# Altium schematic sheet Microcontroller.SchDoc
size A3; SheetNumber: 4; SheetTotal: 5
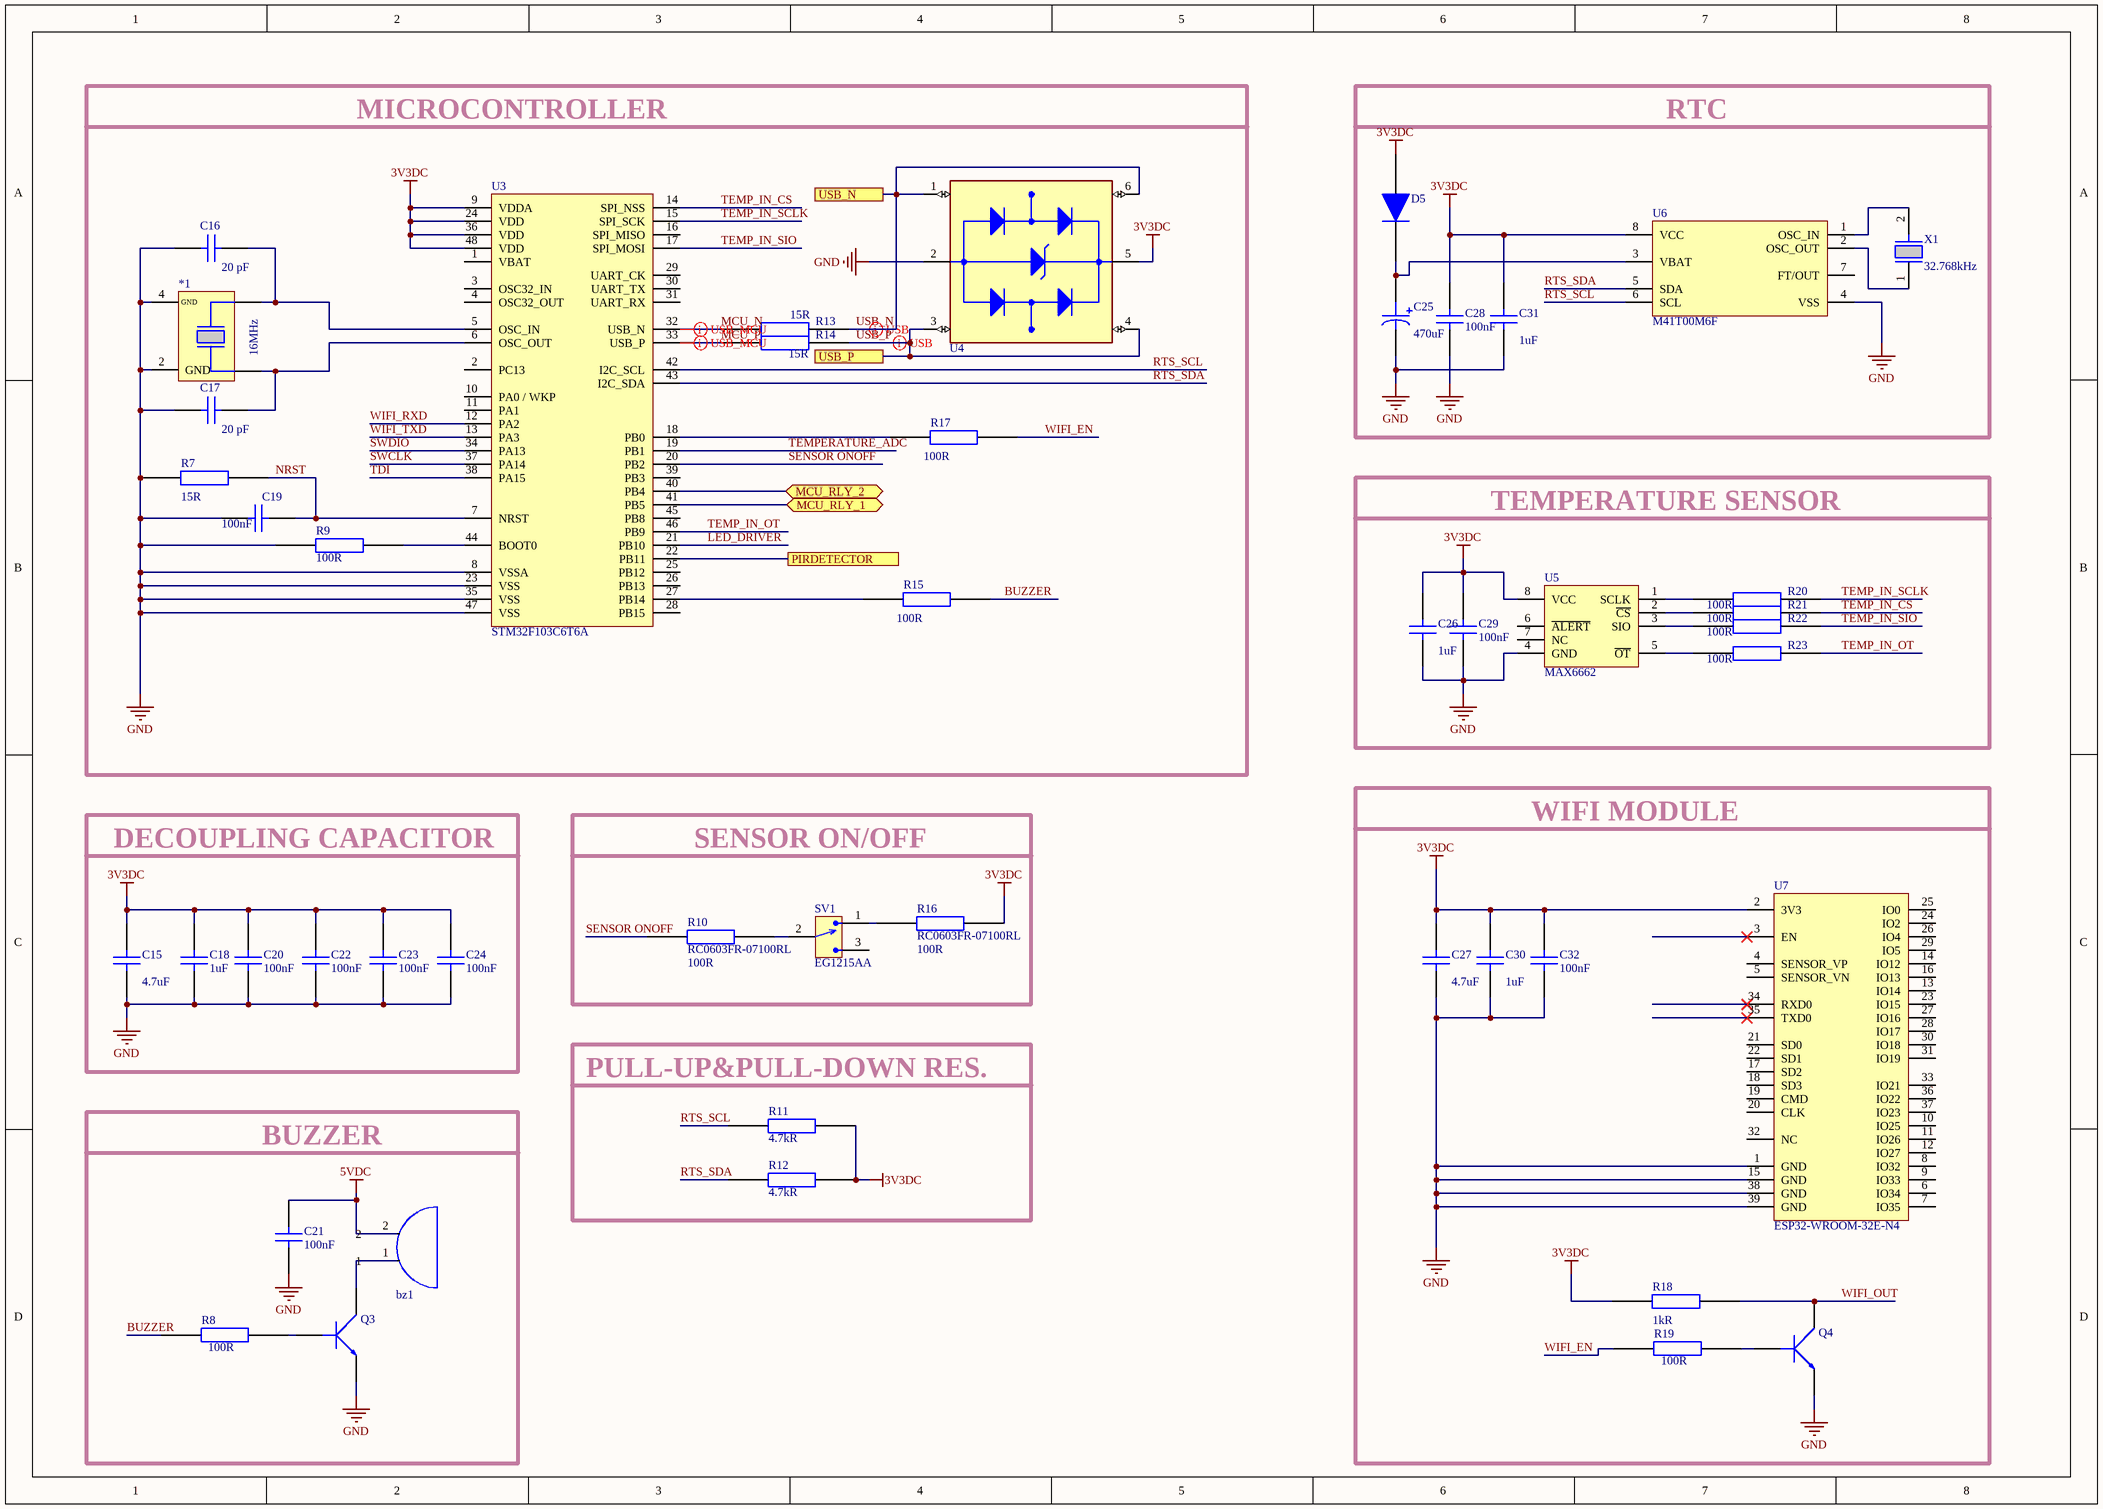
[diagram p0: Microcontroller.SchDoc]

## Parts
*1  Frequency: 16MHz  [ECS]  (hidden comment: CRYSTAL 16MHz)
bz1  2223-CMI-9605IC-0580T-ND  [CMI-9605IC]  (value not drawn)
C15  value 4.7uF  [CAP_0805]  (hidden comment: CL21A475KAQNNNE)
C16  Capaticance: 20 pF  [CAP_0603]  (hidden comment: CL10C200JB8NNNC)
C17  Capaticance: 20 pF  [CAP_0603]  (hidden comment: CL10C200JB8NNNC)
C18  value 1uF  [CAP_0805]  (hidden comment: CL21B105KBFNNNE)
C19  value 100nF  [CAP_0603]  (hidden comment: C0603C104K5RAC7867)
C20  value 100nF  [CAP_0603]  (hidden comment: C0603C104K5RAC7867)
C21  value 100nF  [CAP_0603]  (hidden comment: C0603C104K5RAC7867)
C22  value 100nF  [CAP_0603]  (hidden comment: C0603C104K5RAC7867)
C23  value 100nF  [CAP_0603]  (hidden comment: C0603C104K5RAC7867)
C24  value 100nF  [CAP_0603]  (hidden comment: C0603C104K5RAC7867)
C25  value 470uF  [CAP_EEVSRIES]  (hidden comment: EEV477M025A9PAA)
C26  value 1uF  [CAP_0805]  (hidden comment: CL21B105KBFNNNE)
C27  value 4.7uF  [CAP_0805]  (hidden comment: CL21A475KAQNNNE)
C28  value 100nF  [CAP_0603]  (hidden comment: C0603C104K5RAC7867)
C29  value 100nF  [CAP_0603]  (hidden comment: C0603C104K5RAC7867)
C30  value 1uF  [CAP_0805]  (hidden comment: CL21B105KBFNNNE)
C31  value 1uF  [CAP_0805]  (hidden comment: CL21B105KBFNNNE)
C32  value 100nF  [CAP_0603]  (hidden comment: C0603C104K5RAC7867)
D5  1N4148WS-7-F  [SOD323F]  (value not drawn)
Q3  MMBT3904-7-F  [SOT-23F]  (value not drawn)
Q4  MMBT3904-7-F  [SOT-23F]  (value not drawn)
R7  value 15R  [RES_0603]  (hidden comment: RC0603FR-0715RL)
R8  value 100R  [RES_0603]  (hidden comment: RC0603FR-07100RL)
R9  value 100R  [RES_0603]  (hidden comment: RC0603FR-07100RL)
R10  RC0603FR-07100RL  value 100R  [RES_0603]
R11  value 4.7kR  [RES_0603]  (hidden comment: RC0603FR-074K7L)
R12  value 4.7kR  [RES_0603]  (hidden comment: RC0603FR-074K7L)
R13  value 15R  [RES_0603]  (hidden comment: RC0603FR-0715RL)
R14  value 15R  [RES_0603]  (hidden comment: RC0603FR-0715RL)
R15  value 100R  [RES_0603]  (hidden comment: RC0603FR-07100RL)
R16  RC0603FR-07100RL  value 100R  [RES_0603]
R17  value 100R  [RES_0603]  (hidden comment: RC0603FR-07100RL)
R18  value 1kR  [RES_0603]  (hidden comment: RC0603FR-0710KL)
R19  value 100R  [RES_0603]  (hidden comment: RC0603FR-07100RL)
R20  value 100R  [RES_0603]  (hidden comment: RC0603FR-07100RL)
R21  value 100R  [RES_0603]  (hidden comment: RC0603FR-07100RL)
R22  value 100R  [RES_0603]  (hidden comment: RC0603FR-07100RL)
R23  value 100R  [RES_0603]  (hidden comment: RC0603FR-07100RL)
SV1  EG1215AA  [EG1215AA]
U3  STM32F103C6T6A  [LQFP-48]
U4  USBLC6-2SC6  [SOT23-6L]  (value not drawn)
U5  MAX6662  [SOIC8]
U6  M41T00M6F  [SOIC8]
U7  ESP32-WROOM-32E-N4  [ESP32-32E]
X1  Frequency: 32.768kHz  [ABS05]  (hidden comment: ABS05-32.768KHZ-T)

## Ports
MCU_RLY_1 (bidir, see Power Manangement[4B]), MCU_RLY_2 (bidir, see Power Manangement[6B]), PIRDETECTOR (see Power Manangement[6D], Sensor Board[4B], Sensor Board[6A], Sensor Board[7A]), USB_N (see Power Manangement[6C]), USB_P (see Power Manangement[6C])

## Nets
3V3DC: C15.2 C18.1 C20.1 C22.1 C23.1 C24.1 C26.2 C27.2 C28.2 C29.2 C30.2 C31.2 C32.2 D5.2 R11.1 R12.1 R16.2 R18.1 U3.9(VDDA) U3.24(VDD) U3.36(VDD) U3.48(VDD) U4.5(VBUS) U5.8(VCC) U6.8(VCC) U7.2(3V3)
5VDC: bz1.2 C21.2
GND: *1.2(GND) *1.4(GND) C15.1 C16.1 C17.1 C18.2 C19.1 C20.2 C21.1 C22.2 C23.2 C24.2 C25.2 C26.1 C27.1 C28.1 C29.1 C30.1 C31.1 C32.1 Q3.2(E) Q4.2(E) R7.1 R9.2 U3.8(VSSA) U3.23(VSS) U3.35(VSS) U3.47(VSS) U4.2(GND) U5.4(GND) U6.4(VSS) U7.1(GND) U7.15(GND) U7.38(GND) U7.39(GND)
BUZZER: R8.1 R15.2
LED_DRIVER: U3.21(PB10)
MCU_N: R13.1 U3.32(USB_N)
MCU_P: R14.1 U3.33(USB_P)
MCU_RLY_1: U3.41(PB5) ; port MCU_RLY_1
MCU_RLY_2: U3.40(PB4) ; port MCU_RLY_2
NRST: C19.2 R7.2 U3.7(NRST)
PIRDETECTOR: U3.22(PB11) ; port PIRDETECTOR
RTS_SCL: R11.2 U3.42(I2C_SCL) U6.6(SCL)
RTS_SDA: R12.2 U3.43(I2C_SDA) U6.5(SDA)
SENSOR ONOFF: R10.2 U3.20(PB2)
SWCLK: U3.37(PA14)
SWDIO: U3.34(PA13)
TDI: U3.38(PA15)
TEMP_IN_CS: R21.2 U3.14(SPI_NSS)
TEMP_IN_OT: R23.2 U3.46(PB9)
TEMP_IN_SCLK: R20.2 U3.15(SPI_SCK)
TEMP_IN_SIO: R22.2 U3.17(SPI_MOSI)
TEMPERATURE_ADC: U3.19(PB1)
USB_N: R13.2 U4.1(I/O1_IN) U4.6(I/O1_OUT) ; port USB_N
USB_P: R14.2 U4.3(I/O2_IN) U4.4(I/O2_OUT) ; port USB_P
WIFI_EN: R17.2 R19.1
WIFI_OUT: Q4.3(C) R18.2
WIFI_RXD: U3.12(PA2)
WIFI_TXD: U3.13(PA3)
Net*1_1: *1.1 C17.2 U3.6(OSC_OUT)
Net*1_3: *1.3 C16.2 U3.5(OSC_IN)
Netbz1_1: bz1.1 Q3.3(C)
NetC25_1: C25.1 D5.1 U6.3(VBAT)
NetQ3_1: Q3.1(B) R8.2
NetQ4_1: Q4.1(B) R19.2
NetR9_1: R9.1 U3.44(BOOT0)
NetR10_1: R10.1 SV1.2
NetR15_1: R15.1 U3.27(PB14)
NetR16_1: R16.1 SV1.1
NetR17_1: R17.1 U3.18(PB0)
NetR20_1: R20.1 U5.1(SCLK)
NetR21_1: R21.1 U5.2(~{CS})
NetR22_1: R22.1 U5.3(SIO)
NetR23_1: R23.1 U5.5(~{OT})
NetU6_1: U6.1(OSC_IN) X1.2
NetU6_2: U6.2(OSC_OUT) X1.1

Not connected (* = marked no-connect by the designer): SV1 3; U3 1(VBAT) 2(PC13) 3(OSC32_IN) 4(OSC32_OUT) 10(PA0_/_WKP_) 11(PA1) 16(SPI_MISO) 25(PB12) 26(PB13) 28(PB15) 29(UART_CK) 30(UART_TX) 31(UART_RX) 39(PB3) 45(PB8); U5 6(~{ALERT}) 7(NC); U6 7(FT/OUT); U7 3(EN)* 4(SENSOR_VP) 5(SENSOR_VN) 6(IO34) 7(IO35) 8(IO32) 9(IO33) 10(IO25) 11(IO26) 12(IO27) 13(IO14) 14(IO12) 16(IO13) 17(SD2) 18(SD3) 19(CMD) 20(CLK) 21(SD0) 22(SD1) 23(IO15) 24(IO2) 25(IO0) 26(IO4) 27(IO16) 28(IO17) 29(IO5) 30(IO18) 31(IO19) 32(NC) 33(IO21) 34(RXD0)* 35(TXD0)* 36(IO22) 37(IO23)

## Layout directives
differential pair: MCU_N, MCU_P, USB_N, USB_P

## Notes on the sheet
- MICROCONTROLLER
- RTC
- TEMPERATURE SENSOR
- DECOUPLING CAPACITOR
- SENSOR ON/OFF
- WIFI MODULE
- (near R11) PULL-UP&PULL-DOWN RES.
- BUZZER

## Library data of the parts
*1 = CRYSTAL 16MHz: Crystal 16MHz ±30ppm (Tol) ±50ppm (Stability) 20pF FUND 50Ohm 4-Pin Mini-SMD T/R; Manufacturer: ECS International; Manufacturer Part Number: ECS-160-20-30B-TR; Designed By: Selenay; Supplier: Digikey; Supplier Part Number: XC1120CT-ND; RoHS: Yes; Category: Crystals; Stock: 8959; Pricing: 1=1,34, 10=1,281, 50=1,2514, 100=1,0726, 500=1,04282 (USD); ComponentLink1URL: https://datasheet.ciiva.com/853/ecx-53b-853408.pdf?src-supplier=Digikey; ComponentLink1Description: https://datasheet.ciiva.com/853/ecx-53b-853408.pdf?src-supplier=Digikey; ComponentLink2URL: https://datasheet.ciiva.com/853/ecx-53b-853407.pdf?src-supplier=Digikey; ComponentLink2Description: https://datasheet.ciiva.com/853/ecx-53b-853407.pdf?src-supplier=Digikey; ComponentLink3URL: https://datasheet.ciiva.com/853/ecx-53b-853406.pdf?src-supplier=Digikey; ComponentLink3Description: https://datasheet.ciiva.com/853/ecx-53b-853406.pdf?src-supplier=Digikey
bz1 = 2223-CMI-9605IC-0580T-ND: Audio Buzzer Magnetic 3VDC 7VDC 30mA 5VDC 85dB 2600Hz to 2800Hz Through Hole Pin Box; Manufacturer: CUI Devices; Designed by: Selenay; Shape: 4456Shape; Supplier: Digikey; Supplier Part Number: 2223-CMI-9605IC-0580T-ND; Manufacturer Part Number: CMI-9605IC-0580T; RoHS: No; Category: Audio Products; Stock: 5375; Pricing: 1=1,22, 10=1,014, 25=0,938, 50=0,883, 100=0,8298, 250=0,76976, 500=0,71396, 1000=0,66741, 5000=0,65403 (USD); Length: 9.6mm; Width: 9.6mm; Height: 5mm; Case/Package: CMI-9605IC
C15 C27 = CAP CER 4.7uF 0805: Multilayer Ceramic Capacitor, 4.7 uF, 25 V, ± 10%; Manufacturer: Samsung; Voltage Rating: 25V; Dielectric: X5R; Designed By: Selenay; Supplier: Digikey; Supplier Part Number: 1276-1244-1-ND; Manufacturer Part Number: CL21A475KAQNNNE; RoHS: Yes; Category: Ceramic Capacitors; Stock: 3215685; Pricing: 1=0,1, 10=0,069, 50=0,0414, 100=0,0326, 500=0,02408, 1000=0,01994 (USD); Mounting Technology: Surface Mount; Case/Package: 0805; Case Code (Metric): 2012; Case Code (Imperial): 0805; Material: Ceramic; Min Operating Temperature: -55°C; Max Operating Temperature: 85°C; Packaging: Tape and Reel; Tolerance: 10%; Voltage Rating (DC): 25V; Series: CL; Construction: Flat; Length: 2mm; Height: 1.25mm; Depth: 1.25mm; Radiation Hardening: No; Lead Free: Lead Free; RoHS Compliant: Yes; ComponentLink1URL: https://datasheet.ciiva.com/25798/cl21a475kaqnnne-25798882.pdf?src-supplier=Digikey; ComponentLink1Description: https://datasheet.ciiva.com/25798/cl21a475kaqnnne-25798882.pdf?src-supplier=Digikey
C16 C17 = CAP CER 20pF 0603: Multilayer Ceramic Capacitor, 20 pF, 50 V, ± 5%; Manufacturer: Samsung; Designed By: Selenay; Voltage Rating (DC): 50V; Supplier: Digikey; Supplier Part Number: 1276-1187-1-ND; Manufacturer Part Number: CL10C200JB8NNNC; RoHS: Yes; Category: Ceramic Capacitors; Stock: 298649; Pricing: 1=0,1, 10=0,041, 50=0,0238, 100=0,0184, 500=0,01386, 1000=0,01089 (USD); ComponentLink1URL: https://datasheet.ciiva.com/26877/getdatasheetpartid-640634-26877974.pdf?src-supplier=Verical; ComponentLink1Description: https://datasheet.ciiva.com/26877/getdatasheetpartid-640634-26877974.pdf?src-supplier=Verical; ComponentLink2URL: https://datasheet.ciiva.com/26310/mlcc-catalogdownload2013-eng-26310315.pdf?src-supplier=Distrelec; ComponentLink2Description: https://datasheet.ciiva.com/26310/mlcc-catalogdownload2013-eng-26310315.pdf?src-supplier=Distrelec
C18 C26 C30 C31 = CAP CER 1uF 0805: Multilayer Ceramic Capacitor, 1 uF, 50 V, ± 10%, X7R, 0805 [2012 Metric]; Manufacturer: Samsung; Voltage Rating (DC): 50V; Designed By: Selenay; Supplier: Digikey; Supplier Part Number: 1276-1029-1-ND; Manufacturer Part Number: CL21B105KBFNNNE; RoHS: Yes; Category: Ceramic Capacitors; Stock: 1263322; Pricing: 1=0,11, 10=0,075, 50=0,045, 100=0,0354, 500=0,02616, 1000=0,02165 (USD); Mounting Technology: Surface Mount; Case/Package: 0805; Material: Ceramic; Case Code (Metric): 2012; Case Code (Imperial): 0805; Min Operating Temperature: -55°C; Max Operating Temperature: 125°C; Tolerance: 10%; Packaging: Tape and Reel; Package Quantity: 1; Voltage Rating: 50V; Dielectric: X7R; Voltage: 50V; Series: CL; Construction: Flat; Length: 2mm; Width: 0.049inch; Height: 1.25mm; Thickness: 0.053inch; Depth: 1.25mm; Radiation Hardening: No; RoHS Compliant: Yes; ComponentLink1URL: https://datasheet.ciiva.com/25800/cl21b105kbfnnne-25800291.pdf?src-supplier=Digikey; ComponentLink1Description: https://datasheet.ciiva.com/25800/cl21b105kbfnnne-25800291.pdf?src-supplier=Digikey
C19-C24 C28 C29 C32 = CAP CER 100nF 0603: Multilayer Ceramic Capacitor, 0.1 uF, 50 V, ± 10%, X7R, 0603 [1608 Metric]; Manufacturer: KEMET; Manufacturer Part Number: C0603C104K5RACTU; Designed by: Selenay; Material: 4241ConductorMaterial; Voltage Rating: 50V; Temperature Coefficient: 30ppm/°C; Supplier: Digikey; Supplier Part Number: 399-C0603C104K5RAC7867CT-ND; RoHS: Yes; Category: Ceramic Capacitors; Stock: 2150274; Pricing: 1=0,11, 10=0,074, 50=0,0424, 100=0,0329, 500=0,02474, 1000=0,01944 (USD); Mounting Technology: Surface Mount; Case/Package: 0603; Min Operating Temperature: -55°C; Max Operating Temperature: 125°C; Tolerance: 10%; Dielectric: X7R; Packaging: Tape and Reel; Voltage: 50V; Series: SMD Comm X7R; Length: 0.063inch; Width: 0.031inch; Thickness: 0.034inch; RoHS Compliant: Yes; Lead Free: 5697LeadFree
C25 = CAP ALU 470uF: Cap Aluminum Lytic 470uF 25V 20% (10 X 10.2mm) SMD 850mA 2000h 105C T/R; Manufacturer: KEMET; Designed By: Selenay; Supplier: Digikey; Supplier Part Number: 399-6719-1-ND; Manufacturer Part Number: EEV477M025A9PAA; RoHS: Yes; Category: Aluminum Electrolytic Capacitors; Stock: 10504; Pricing: 1=0,89, 10=0,641, 50=0,5602, 100=0,4564 (USD); ComponentLink1URL: http://www.mouser.com/ds/2/212/KEM_A4002_EEV-535332.pdf?src-supplier=Mouser; ComponentLink1Description: http://www.mouser.com/ds/2/212/KEM_A4002_EEV-535332.pdf?src-supplier=Mouser; ComponentLink2URL: https://api.kemet.com/component-edge/download/datasheet/EEV477M025A9PAA.pdf?src-supplier=Digikey; ComponentLink2Description: https://api.kemet.com/component-edge/download/datasheet/EEV477M025A9PAA.pdf?src-supplier=Digikey; ComponentLink3URL: https://search.kemet.com/component-edge/download/datasheet/EEV477M025A9PAA.pdf?src-supplier=Digikey; ComponentLink3Description: https://search.kemet.com/component-edge/download/datasheet/EEV477M025A9PAA.pdf?src-supplier=Digikey; ComponentLink4URL: https://datasheet.octopart.com/EEV477M025A9PAA-KEMET-datasheet-169316327.pdf?src-supplier=Newark; ComponentLink4Description: https://datasheet.octopart.com/EEV477M025A9PAA-KEMET-datasheet-169316327.pdf?src-supplier=Newark
D5 = 1N4148WS: Small Signal Diode, 100V, SOD-323; Manufacturer: Diodes; Forward Current: 300mA; Max Repetitive Reverse Voltage (Vrrm): 75V; Max Reverse Current: 1uA; Reverse Recovery Time: 4ns; Peak Non-Repetitive Surge Current: 2A; Forward Voltage: 1.25V; Average Rectified Current: 150mA; Power Dissipation: 200mW; Polarity: Standard; Value: 2pF; Supplier: Digikey; Supplier Part Number: 1N4148WS-FDICT-ND; Manufacturer Part Number: 1N4148WS-7-F; RoHS: Yes; Category: LDO; Stock: 131688; Pricing: 1=0,17, 10=0,121, 100=0,0652, 500=0,05122, 1000=0,03557 (USD); Mounting Technology: Surface Mount; Pins: 2; Weight: 0.000173oz; Min Operating Temperature: -65°C; Max Operating Temperature: 150°C; Max Forward Surge Current (Ifsm): 2A; Max Surge Current: 2A; Packaging: Tape and Reel; Recovery Time: 4ns; Package Quantity: 3000; Voltage Rating (DC): 75V; Power Rating: 200mW; Current Rating: 150mA; Output Current: 150mA; Voltage: 75V; Max Reverse Voltage (DC): 75V; Series: -; Reverse Recovery Time-Max: 4ns; Length: 1.8mm; Width: 1.4mm; Height: 1mm; Radiation Hardening: No; Reach SVHC Compliant: No; Lead Free: Lead Free; RoHS Compliant: Yes; ComponentLink1URL: https://datasheet.ciiva.com/1179/ds30097-1179355.pdf?src-supplier=Element14; ComponentLink1Description: https://datasheet.ciiva.com/1179/ds30097-1179355.pdf?src-supplier=Element14; ComponentLink2URL: https://datasheet.ciiva.com/8300/ds30097-8300396.pdf?src-supplier=Avnet; ComponentLink2Description: https://datasheet.ciiva.com/8300/ds30097-8300396.pdf?src-supplier=Avnet; ComponentLink3URL: https://datasheet.ciiva.com/16199/ds30097-16199061.pdf?src-supplier=Future+Electronics; ComponentLink3Description: https://datasheet.ciiva.com/16199/ds30097-16199061.pdf?src-supplier=Future+Electronics; ComponentLink4URL: https://datasheet.ciiva.com/911/ds30097-911742.pdf?src-supplier=Digikey; ComponentLink4Description: https://datasheet.ciiva.com/911/ds30097-911742.pdf?src-supplier=Digikey; ComponentLink5URL: https://datasheet.ciiva.com/911/ds30097-911743.pdf?src-supplier=Digikey; ComponentLink5Description: https://datasheet.ciiva.com/911/ds30097-911743.pdf?src-supplier=Digikey; ComponentLink6URL: https://datasheet.ciiva.com/911/ds30097-911741.pdf?src-supplier=Digikey; ComponentLink6Description: https://datasheet.ciiva.com/911/ds30097-911741.pdf?src-supplier=Digikey
Q3 Q4 = MMBT3904-7-F: Transistor General Purpose BJT NPN 40 Volt 0.2A Automotive 3-Pin SOT-23; Manufacturer: Diodes Zetex; Designed By: Selenay; Max Power Dissipation: 300mW; Collector Emitter Voltage (VCEO): 40V; Max Collector Current: 200mA; Collector Base Voltage (VCBO): 60V; Power Dissipation: 350mW; Frequency: 300MHz; hFE Min: 100; Number of Elements: 1; Emitter Base Voltage (VEBO): 6V; Collector Emitter Saturation Voltage: 300mV; Supplier: Digikey; Supplier Part Number: MMBT3904-FDICT-ND; Manufacturer Part Number: MMBT3904-7-F; RoHS: Yes; Category: BJTs; Stock: 4398181; Pricing: 1=0,12, 10=0,086, 100=0,0467, 500=0,03666, 1000=0,02545 (USD); Mounting Technology: Surface Mount; Case/Package: SOT-23; Pins: 3; Weight: 0.000282oz; Min Operating Temperature: -55°C; Max Operating Temperature: 150°C; Polarity: NPN; Packaging: Tape and Reel; Voltage Rating (DC): 40V; Package Quantity: 3000; Transition Frequency: 300MHz; Collector Emitter Breakdown Voltage: 40V; Max Breakdown Voltage: 40V; Continuous Collector Current: 200mA; Clock Frequency: 300MHz; Gain Bandwidth Product: 300MHz; Series: Automotive, AEC-Q101; Collector-emitter Voltage-Max: 300mV; Length: 3.05mm; Width: 1.4mm; Height: 1mm; Radiation Hardening: No; Reach SVHC Compliant: No; Lead Free: Lead Free; RoHS Compliant: Yes; ComponentLink1URL: https://datasheet.ciiva.com/11201/ds30036-11201778.pdf?src-supplier=Avnet; ComponentLink1Description: https://datasheet.ciiva.com/11201/ds30036-11201778.pdf?src-supplier=Avnet; ComponentLink2URL: https://datasheet.ciiva.com/15138/getdatasheetpartid-53265-15138780.pdf?src-supplier=Verical; ComponentLink2Description: https://datasheet.ciiva.com/15138/getdatasheetpartid-53265-15138780.pdf?src-supplier=Verical; ComponentLink3URL: https://datasheet.ciiva.com/22711/1915516-22711750.pdf?src-supplier=Element14; ComponentLink3Description: https://datasheet.ciiva.com/22711/1915516-22711750.pdf?src-supplier=Element14; ComponentLink4URL: https://datasheet.ciiva.com/11198/ds30036-11198999.pdf?src-supplier=Avnet; ComponentLink4Description: https://datasheet.ciiva.com/11198/ds30036-11198999.pdf?src-supplier=Avnet; ComponentLink5URL: https://datasheet.ciiva.com/6361/ds30036-6361256.pdf?src-supplier=Digikey; ComponentLink5Description: https://datasheet.ciiva.com/6361/ds30036-6361256.pdf?src-supplier=Digikey; ComponentLink6URL: https://datasheet.ciiva.com/6361/ds30036-6361254.pdf?src-supplier=Digikey; ComponentLink6Description: https://datasheet.ciiva.com/6361/ds30036-6361254.pdf?src-supplier=Digikey
R7 R13 R14 = RES 15 OHM 0603: SMD Chip Resistor, 15 Ohm, ± 1%, 100 mW, 0603; Manufacturer: Yageo; Designed By: Selenay; Current Rating: 50mA; Voltage Rating (AC): 50V; Supplier: Digikey; Supplier Part Number: 311-15.0HRCT-ND; Manufacturer Part Number: RC0603FR-0715RL; RoHS: Yes; Category: Chip SMD Resistors; Stock: 404012; Pricing: 1=0,1, 10=0,019, 50=0,0112, 100=0,0093, 500=0,00622, 1000=0,00532 (USD); Contact Material: 157ConductorMaterial; Weight: 250mg; Lead Free: 5697LeadFree; ComponentLink1URL: https://datasheet.ciiva.com/5989/1686128-5989704.pdf?src-supplier=Farnell; ComponentLink1Description: https://datasheet.ciiva.com/5989/1686128-5989704.pdf?src-supplier=Farnell; ComponentLink2URL: https://datasheet.ciiva.com/8890/pyu-rc0603-51-rohs-l-4-8890742.pdf?src-supplier=Avnet; ComponentLink2Description: https://datasheet.ciiva.com/8890/pyu-rc0603-51-rohs-l-4-8890742.pdf?src-supplier=Avnet; ComponentLink3URL: https://datasheet.ciiva.com/12557/rc0603-272842-12557839.pdf?src-supplier=Mouser; ComponentLink3Description: https://datasheet.ciiva.com/12557/rc0603-272842-12557839.pdf?src-supplier=Mouser; ComponentLink4URL: https://datasheet.ciiva.com/2454/pyu-r-int-thick-7-2454840.pdf?src-supplier=Digikey; ComponentLink4Description: https://datasheet.ciiva.com/2454/pyu-r-int-thick-7-2454840.pdf?src-supplier=Digikey; ComponentLink5URL: https://datasheet.ciiva.com/2454/pyu-r-int-thick-7-2454841.pdf?src-supplier=Digikey; ComponentLink5Description: https://datasheet.ciiva.com/2454/pyu-r-int-thick-7-2454841.pdf?src-supplier=Digikey; ComponentLink6URL: https://datasheet.ciiva.com/2454/pyu-r-int-thick-7-2454842.pdf?src-supplier=Digikey; ComponentLink6Description: https://datasheet.ciiva.com/2454/pyu-r-int-thick-7-2454842.pdf?src-supplier=Digikey; ComponentLink7URL: https://datasheet.ciiva.com/7746/443971-7746262.pdf?src-supplier=Element14; ComponentLink7Description: https://datasheet.ciiva.com/7746/443971-7746262.pdf?src-supplier=Element14; ComponentLink8URL: https://datasheet.ciiva.com/7746/443971-7746263.pdf?src-supplier=Element14; ComponentLink8Description: https://datasheet.ciiva.com/7746/443971-7746263.pdf?src-supplier=Element14
R8-R10 R15-R17 R19-R23 = RES 100 OHM 0603: SMD Chip Resistor, 100 Ohm, ± 1%, 100 mW, 0603; Manufacturer: Yageo; Designed By: Selenay; Temperature Coefficient: 100ppm/°C; Voltage Rating (DC): 50V; Power Rating: 100mW; Supplier: Digikey; Supplier Part Number: 311-100HRCT-ND; Manufacturer Part Number: RC0603FR-07100RL; RoHS: Yes; Category: Chip SMD Resistors; Stock: 3016709; Pricing: 1=0,1, 10=0,019, 50=0,0112, 100=0,0093, 500=0,00622, 1000=0,00532 (USD); Case/Package: 0603; Pins: 2; Case Code (Imperial): 0603; Case Code (Metric): 1608; Min Operating Temperature: -55°C; Max Operating Temperature: 155°C; Tolerance: 1%; Resistor Type: Thick Film; Packaging: Tape and Reel; Voltage Rating: 50V; Termination: SMD/SMT; Features: Moisture Resistant; Series: RC; Max Power Dissipation: 100mW; Number of Terminations: 2; Construction: Rectangular; Resistance Tolerance: 1%; Technology: THICK FILM; Length: 1.6mm; Width: 0.8mm; Height: 0.45mm; Depth: 0.8mm; Lead Free: Lead Free; Reach SVHC Compliant: Unknown; RoHS Compliant: Yes; Military Standard: Not
R11 R12 = RES 4.7K OHM 0603: SMD Chip Resistor, 4.7 kOhm, ± 1%, 100 mW, 0603 [1608 Metric], Thick Film, General Purpose; Manufacturer: Yageo; Power Rating: 100mW; Voltage Rating (DC): 50V; Temperature Coefficient: 100ppm/°C; Supplier: Digikey; Supplier Part Number: 311-4.70KHRCT-ND; Manufacturer Part Number: RC0603FR-074K7L; RoHS: Yes; Category: Chip SMD Resistors; Stock: 3832883; Pricing: 1=0,1, 10=0,019, 50=0,0112, 100=0,0093, 500=0,00622, 1000=0,00532 (USD); Case/Package: 0603; Pins: 2; Case Code (Imperial): 0603; Case Code (Metric): 1608; Min Operating Temperature: -55°C; Max Operating Temperature: 155°C; Tolerance: 1%; Resistor Type: Thick Film; Packaging: Tape and Reel; Voltage Rating: 50V; Termination: SMD/SMT; Features: Moisture Resistant; Series: RC; Max Power Dissipation: 100mW; Number of Terminations: 2; Construction: Rectangular; Resistance Tolerance: 1%; Length: 1.6mm; Width: 0.8mm; Depth: 0.8mm; Lead Pitch: 0.3mm; Reach SVHC Compliant: Unknown; Lead Free: 5697LeadFree; RoHS Compliant: Yes; Military Standard: Not; ComponentLink1URL: https://datasheet.ciiva.com/15189/getdatasheetpartid-422754-15189760.pdf?src-supplier=Verical; ComponentLink1Description: https://datasheet.ciiva.com/15189/getdatasheetpartid-422754-15189760.pdf?src-supplier=Verical; ComponentLink2URL: https://datasheet.ciiva.com/7660/38590-7660794.pdf?src-supplier=Element14; ComponentLink2Description: https://datasheet.ciiva.com/7660/38590-7660794.pdf?src-supplier=Element14; ComponentLink3URL: https://datasheet.ciiva.com/22747/443971-22747528.pdf?src-supplier=Element14; ComponentLink3Description: https://datasheet.ciiva.com/22747/443971-22747528.pdf?src-supplier=Element14; ComponentLink4URL: https://datasheet.ciiva.com/46440/1868787-46440909.pdf?src-supplier=Element14; ComponentLink4Description: https://datasheet.ciiva.com/46440/1868787-46440909.pdf?src-supplier=Element14; ComponentLink5URL: https://datasheet.ciiva.com/7746/1868787-7746365.pdf?src-supplier=Element14; ComponentLink5Description: https://datasheet.ciiva.com/7746/1868787-7746365.pdf?src-supplier=Element14; ComponentLink6URL: https://datasheet.ciiva.com/7746/1738695-7746366.pdf?src-supplier=Element14; ComponentLink6Description: https://datasheet.ciiva.com/7746/1738695-7746366.pdf?src-supplier=Element14
R18 = RES 1K OHM 0603: SMD Chip Resistor, 1 kOhm, ± 1%, 100 mW, 0603 [1608 Metric], Thick Film, General Purpose; Manufacturer: Yageo; Manufacturer Part Number: RC0603FR-071KL; Designed by: Selenay; Temperature Coefficient: 100ppm/°C; Power Rating: 100mW; Voltage Rating: 50V; Supplier: Digikey; Supplier Part Number: 311-1.00KHRCT-ND; RoHS: Yes; Category: Chip SMD Resistors; Stock: 14334502; Pricing: 1=0,1, 10=0,019, 50=0,0112, 100=0,0093, 500=0,00622, 1000=0,00532 (USD); Case/Package: 0603; Contact Plating: Tin,Matte; Case Code (Imperial): 0603; Case Code (Metric): 1608; Min Operating Temperature: -55°C; Max Operating Temperature: 155°C; Tolerance: 1%; Packaging: Tape and Reel; Resistor Type: Thick Film; Termination: SMD/SMT; Features: Moisture Resistant; Series: RC; Max Power Dissipation: 100mW; Number of Terminations: 2; Resistance Tolerance: 1%; Construction: Rectangular; Technology: THICK FILM; Length: 1.6mm; Height: 0.45mm; Depth: 0.8mm; Reach SVHC Compliant: No; Lead Free: 5697LeadFree; Military Standard: Not; RoHS Compliant: Yes
SV1 = EG1215AA: Slide Switch, SPDT, 0.025A, 24V, SMD; Manufacturer: E-Switch; Mechanical Life: 10000Cycles; Switch Function: On-On; Actuator Type: Standard; Switch Travel: 1.5mm; Operating Force: 150gf; Actuator Length: 1.4mm; Designed by: Selenay; Supplier: Digikey; Supplier Part Number: EG5720CT-ND; Manufacturer Part Number: EG1215AA; RoHS: Yes; Stock: 21567; Pricing: 1=0,99, 10=0,951, 25=0,8884, 100=0,7715, 250=0,702, 500=0,6508, 1000=0,60327 (USD); Mounting Technology: Surface Mount; Min Operating Temperature: -20°C; Max Operating Temperature: 70°C; Throw Configuration: SPDT; Packaging: Cut Tape; Voltage Rating (DC): 24V; Termination: Gull Wing; Electrical Life: 10000Cycles; Series: EG; RoHS Compliant: Yes; ComponentLink1URL: https://media.digikey.com/pdf/Data%20Sheets/E-Switch%20PDFs/EG1215_Series_Ds.pdf?src-supplier=Digikey; ComponentLink1Description: https://media.digikey.com/pdf/Data%20Sheets/E-Switch%20PDFs/EG1215_Series_Ds.pdf?src-supplier=Digikey; ComponentLink2URL: http://www.farnell.com/datasheets/2645007.pdf?src-supplier=Farnell; ComponentLink2Description: http://www.farnell.com/datasheets/2645007.pdf?src-supplier=Farnell
U3 = STM32F103C6T6A: MCU 32-bit STM32F ARM Cortex M3 RISC 32KB Flash 2.5V/3.3V 48-Pin LQFP Tray; Manufacturer: STMicroelectronics; Number of Timers/Counters: 3; Max Supply Voltage: 3.6V; Interface: I2C,SPI,USART; RAM Size: 10KB; Number of I/Os: 37; Min Supply Voltage: 2V; Data Bus Width: 32b; Clock Frequency: 72MHz; Number of ADC Channels: 10; Designer By: Selenay; Supplier: Digikey; Supplier Part Number: 497-11515-ND; Manufacturer Part Number: STM32F103C6T6A; RoHS: Yes; Category: Microcontrollers; Stock: 1440; Pricing: 1=6,07, 10=5,453, 25=5,1552, 80=4,46775, 250=4,23868, 500=3,80336, 1000=3,20766, 2500=3,04728 (USD); Case/Package: LQFP; Pins: 48; Weight: 0.006409oz; Min Operating Temperature: -40°C; Max Operating Temperature: 85°C; Packaging: Tray; Series: STM32F103C6; Package Quantity: 1500; Memory Format: FLASH; Memory Size: 32KB; Core Architecture: ARM; Length: 7mm; Width: 7mm; Height: 1.4mm; Lead Free: Lead Free; RoHS Compliant: Yes; ComponentLink1URL: https://datasheet.ciiva.com/15122/getdatasheetpartid-69879-15122075.pdf?src-supplier=Verical; ComponentLink1Description: https://datasheet.ciiva.com/15122/getdatasheetpartid-69879-15122075.pdf?src-supplier=Verical; ComponentLink2URL: https://datasheet.ciiva.com/14100/pustm-arm-microcont-stm32f103-en-14100507.pdf?src-supplier=Distrelec; ComponentLink2Description: https://datasheet.ciiva.com/14100/pustm-arm-microcont-stm32f103-en-14100507.pdf?src-supplier=Distrelec
U4 = USB PROTECTION: ESD Suppressor Diode Arrays Uni-Dir 15kV@Air Gap/8kV@Contact Disc 6-Pin SOT-23 T/R; Manufacturer: STMicroelectronics; Designed By: Selenay; Direction: Unidirectional,Bidirectional; Value: 3.5pF; Operating Supply Voltage: 1.1V; Number of Channels: 2; Breakdown Voltage: 6V; Clamping Voltage: 17V; Reverse Standoff Voltage: 5.25V; Power Line Protection: Yes; Test Current: 1mA; Max Reverse Leakage Current: 150nA; Peak Pulse Current: 5A; Data Rate: 480Mbps; Number of Elements: 1; Working Voltage: 5V; Supplier: Digikey; Supplier Part Number: 497-5235-1-ND; Manufacturer Part Number: USBLC6-2SC6; RoHS: Yes; Category: TVS Diodes; Stock: 2173; Pricing: 1=0,35, 10=0,273, 100=0,1636, 500=0,1515, 1000=0,10302 (USD); Mounting Technology: Surface Mount; Case/Package: SOT-23; Pins: 6; Min Operating Temperature: -40°C; Max Operating Temperature: 125°C; Packaging: Tape and Reel; Package Quantity: 3000; Termination: SMD/SMT; Number of Bidirectional Channels: 2; Min Breakdown Voltage: 6V; ESD Protection: Yes; Leakage Current: 150nA; Series: USB; Reverse Breakdown Voltage: 6V; Polarity: Unidirectional,Bidirectional; Max Breakdown Voltage: 6V; Clamping Voltage-Max: 17V; Max Repetitive Reverse Voltage (Vrrm): 5.25V; Length: 3.05mm; Width: 1.75mm; Height: 1.3mm; Depth: 1.75mm; Radiation Hardening: No; Lead Free: Lead Free; Reach SVHC Compliant: No; RoHS Compliant: Yes; ComponentLink1URL: https://datasheet.ciiva.com/1268/1690354-1268384.pdf?src-supplier=Element14; ComponentLink1Description: https://datasheet.ciiva.com/1268/1690354-1268384.pdf?src-supplier=Element14; ComponentLink2URL: https://datasheet.ciiva.com/4508/cd00050750-113117-4508433.pdf?src-supplier=Mouser; ComponentLink2Description: https://datasheet.ciiva.com/4508/cd00050750-113117-4508433.pdf?src-supplier=Mouser; ComponentLink3URL: https://datasheet.ciiva.com/15143/getdatasheetpartid-148465-15143789.pdf?src-supplier=Verical; ComponentLink3Description: https://datasheet.ciiva.com/15143/getdatasheetpartid-148465-15143789.pdf?src-supplier=Verical; ComponentLink4URL: https://datasheet.ciiva.com/16200/cd00050750-16200026.pdf?src-supplier=Future+Electronics; ComponentLink4Description: https://datasheet.ciiva.com/16200/cd00050750-16200026.pdf?src-supplier=Future+Electronics; ComponentLink5URL: https://datasheet.ciiva.com/41444/001184109-da-01-en-ic-esd-protecti-usblc6-2sc6-sot-23-6-stm-41444156.pdf?src-supplier=Conrad; ComponentLink5Description: https://datasheet.ciiva.com/41444/001184109-da-01-en-ic-esd-protecti-usblc6-2sc6-sot-23-6-stm-41444156.pdf?src-supplier=Conrad
U5 = MAX6662: Temp Sensor Digital Serial (3-Wire, SPI) 8-Pin SOIC N Tube; Manufacturer: Maxim; Manufacturer Part Number: MAX6662MSA+; Designed By: Selenay; Supplier: Digikey; Supplier Part Number: MAX6662MSA+-ND; RoHS: Yes; Category: Temperature and Humidity Sensors; Stock: 708; Pricing: 1=4,61, 10=3,454, 25=3,0704, 50=2,9168, 100=2,8401, 500=2,37956, 1000=2,22604 (USD); ComponentLink1URL: https://datasheet.ciiva.com/5299/max6662-89142-5299456.pdf?src-supplier=Mouser; ComponentLink1Description: https://datasheet.ciiva.com/5299/max6662-89142-5299456.pdf?src-supplier=Mouser; ComponentLink2URL: https://datasheet.ciiva.com/3277/max6662-3277979.pdf?src-supplier=Avnet; ComponentLink2Description: https://datasheet.ciiva.com/3277/max6662-3277979.pdf?src-supplier=Avnet; ComponentLink3URL: https://datasheet.ciiva.com/2003/max6662-2003390.pdf?src-supplier=Digikey; ComponentLink3Description: https://datasheet.ciiva.com/2003/max6662-2003390.pdf?src-supplier=Digikey
U6 = M41T00M6F: Real-time Clocks Clock/Calendar I2C, 2-Wire Serial 70uA @ 2V ~ 5.5V SOIC-8_150mil RoHS; Manufacturer: STMicroelectronics; Designed by: SELENAY; Supplier: Digikey; Supplier Part Number: 497-4697-1-ND; Manufacturer Part Number: M41T00M6F; RoHS: Yes; Category: Real Time Clocks; Stock: 22197; Pricing: 1=3,77, 10=3,388, 25=3,2032, 100=2,776, 250=2,63364, 500=2,36316, 1000=1,99303 (USD); ComponentLink1URL: https://datasheet.ciiva.com/7630/1837112-7630077.pdf?src-supplier=Element14; ComponentLink1Description: https://datasheet.ciiva.com/7630/1837112-7630077.pdf?src-supplier=Element14; ComponentLink2URL: https://datasheet.ciiva.com/16213/cd00001542-16213654.pdf?src-supplier=Future+Electronics; ComponentLink2Description: https://datasheet.ciiva.com/16213/cd00001542-16213654.pdf?src-supplier=Future+Electronics; ComponentLink3URL: https://datasheet.ciiva.com/41459/001185345-da-01-en-ic-rtc-srl-512kbit-m41t00m6f-soic-8-stm-41459818.pdf?src-supplier=Conrad; ComponentLink3Description: https://datasheet.ciiva.com/41459/001185345-da-01-en-ic-rtc-srl-512kbit-m41t00m6f-soic-8-stm-41459818.pdf?src-supplier=Conrad
U7 = ESP32-WROOM-32E-N4: SMD module, ESP32-D0WD-V3, ESP32 ECO V3, 4 MB SPI flash, PCB antenna; Manufacturer: Espressif Systems; Manufacturer Part Number: ESP32-WROOM-32E(M113EH3200PH3Q0); Designed by: SELENAY; Interface: 39,40,1515,1518,1532Interface; Bandwidth: 72MHz; Data Rate: 150Mbps; Clock Frequency: 2.484GHz; Max Supply Voltage: 3.6V; Min Supply Voltage: 3V; Nominal Supply Current: 500mA; Number of ADC Channels: 16NUMBER; Number of GPIO: 26NUMBER; Supplier: Digikey; Supplier Part Number: 1965-ESP32-WROOM-32E-N4TR-ND; RoHS: No; Category: RF Receivers, Transceivers; Pricing: 650=2,5 (USD); Min Operating Temperature: -40°C; Max Operating Temperature: 85°C; Height: 3.25mm; ComponentLink1Description: Datasheet; ComponentLink1URL: https://www.espressif.com/sites/default/files/documentation/esp32-wroom-32e_esp32-wroom-32ue_datasheet_en.pdf
X1 = CRYSTAL 32768KHz: Crystal 0.032768MHz ±20ppm (Tol) 12.5pF Flexural 90000Ohm 2-Pin CSMD T/R; Manufacturer: Abracon; Designed By: Selenay; ESR (Equivalent Series Resistance): 90kR; Supplier: Digikey; Supplier Part Number: 535-11899-1-ND; Manufacturer Part Number: ABS05-32.768KHZ-T; RoHS: Yes; Category: Crystals; Stock: 126394; Pricing: 1=0,75, 10=0,628, 50=0,565, 100=0,5022, 500=0,4771, 1000=0,40177 (USD); Mounting Technology: Surface Mount; Case/Package: CSMD; Pins: 2; Min Operating Temperature: -40°C; Max Operating Temperature: 85°C; Packaging: Tape and Reel; Frequency Tolerance: 20ppm; Load Capacitance: 12.5pF; Package Quantity: 3000; Tolerance: 20ppm; Termination: SMD/SMT; ESR: 90kR; Series: ABS05; Operating Frequency: 32.768 kHz; Length: 1.6mm; Width: 1mm; Height: 0.5mm; Depth: 1mm; Radiation Hardening: No; Reach SVHC Compliant: No; Lead Free: Lead Free; RoHS Compliant: Yes; ComponentLink1URL: https://datasheet.ciiva.com/23810/abs05-23810480.pdf?src-supplier=Newark; ComponentLink1Description: https://datasheet.ciiva.com/23810/abs05-23810480.pdf?src-supplier=Newark; ComponentLink2URL: https://datasheet.ciiva.com/6728/abs05-6728949.pdf?src-supplier=Digikey; ComponentLink2Description: https://datasheet.ciiva.com/6728/abs05-6728949.pdf?src-supplier=Digikey; ComponentLink3URL: https://datasheet.ciiva.com/6728/abs05-6728950.pdf?src-supplier=Digikey; ComponentLink3Description: https://datasheet.ciiva.com/6728/abs05-6728950.pdf?src-supplier=Digikey; ComponentLink4URL: https://datasheet.ciiva.com/16411/abs05-16411149.pdf?src-supplier=Future+Electronics; ComponentLink4Description: https://datasheet.ciiva.com/16411/abs05-16411149.pdf?src-supplier=Future+Electronics